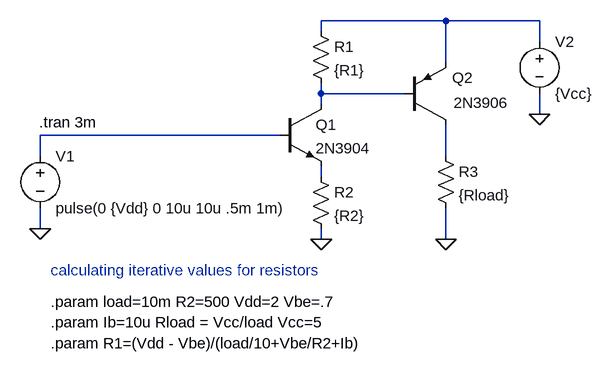
[diagram p0: schematic IteR.asc]
IteR.asc, the LTspice schematic file:
Version 4
SHEET 1 892 900
WIRE -304 448 -304 416
WIRE -304 560 -304 528
WIRE 64 416 -304 416
WIRE 128 256 128 240
WIRE 128 352 128 336
WIRE 128 368 128 352
WIRE 128 480 128 464
WIRE 128 576 128 560
WIRE 256 352 128 352
WIRE 320 240 128 240
WIRE 320 304 320 240
WIRE 320 448 320 400
WIRE 320 576 320 528
WIRE 464 240 320 240
WIRE 464 272 464 240
WIRE 464 384 464 352
FLAG 128 576 0
FLAG 320 576 0
FLAG -304 560 0
FLAG 464 384 0
SYMBOL npn 64 368 R0
SYMATTR InstName Q1
SYMATTR Value 2N3904
SYMBOL pnp 256 400 M180
WINDOW 0 74 72 Left 0
WINDOW 3 76 34 Left 0
SYMATTR InstName Q2
SYMATTR Value 2N3906
SYMBOL res 112 240 R0
SYMATTR InstName R1
SYMATTR Value {R1}
SYMBOL res 112 464 R0
SYMATTR InstName R2
SYMATTR Value {R2}
SYMBOL voltage -304 432 R0
SYMATTR InstName V1
SYMATTR Value pulse(0 {Vdd} 0 10u 10u .5m 1m)
SYMBOL voltage 464 256 R0
SYMATTR InstName V2
SYMATTR Value {Vcc}
SYMBOL res 304 432 R0
SYMATTR InstName R3
SYMATTR Value {Rload}
TEXT -288 672 Left 0 !.param load=10m R2=500 Vdd=2 Vbe=.7
TEXT -288 736 Left 0 !.param R1=(Vdd - Vbe)/(load/10+Vbe/R2+Ib)
TEXT -306 396 Left 0 !.tran 3m
TEXT -288 704 Left 0 !.param Ib=10u Rload = Vcc/load Vcc=5
TEXT -288 624 Left 0 ;calculating iterative values for resistors

The netlist it stands for:
* IteR.asc
Q1 N003 N001 N004 0 2N3904
Q2 N005 N003 N002 0 2N3906
R1 N002 N003 {R1}
R2 N004 0 {R2}
V1 N001 0 pulse(0 {Vdd} 0 10u 10u .5m 1m)
V2 N002 0 {Vcc}
R3 N005 0 {Rload}
.model NPN NPN
.model PNP PNP
.lib standard.bjt
.param load=10m R2=500 Vdd=2 Vbe=.7
.param R1=(Vdd - Vbe)/(load/10+Vbe/R2+Ib)
.tran 3m
.param Ib=10u Rload = Vcc/load Vcc=5
* calculating iterative values for resistors
.backanno
.end